# Altium schematic sheet belt_output.SchDoc
size A3
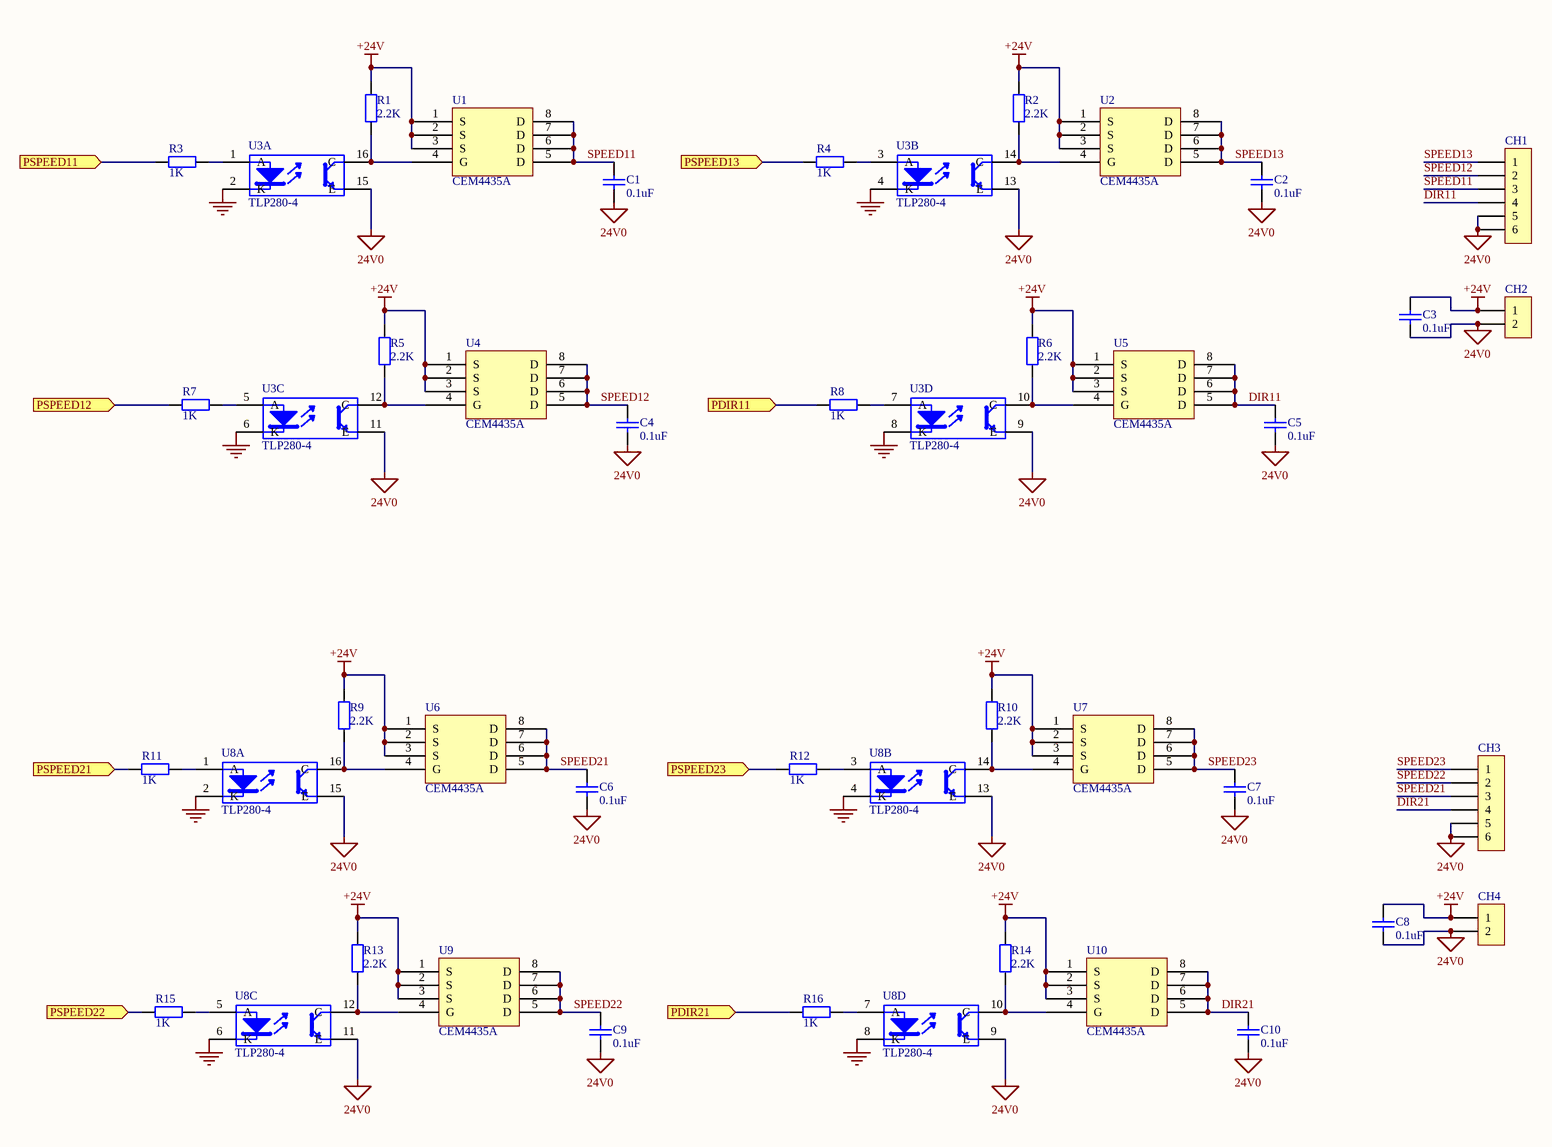
[diagram p0: belt_output.SchDoc]

## Parts
C1  value 0.1uF  [0805]  (hidden comment: Cap)
C2  value 0.1uF  [0805]  (hidden comment: Cap)
C3  value 0.1uF  [0805]  (hidden comment: Cap)
C4  value 0.1uF  [0805]  (hidden comment: Cap)
C5  value 0.1uF  [0805]  (hidden comment: Cap)
C6  value 0.1uF  [0805]  (hidden comment: Cap)
C7  value 0.1uF  [0805]  (hidden comment: Cap)
C8  value 0.1uF  [0805]  (hidden comment: Cap)
C9  value 0.1uF  [0805]  (hidden comment: Cap)
C10  value 0.1uF  [0805]  (hidden comment: Cap)
CH1  HEADER1X6  [CH3.96-6PIN]  (value not drawn)
CH2  HEADER1X2  [CH3.96-2PIN]  (value not drawn)
CH3  HEADER1X6  [CH3.96-6PIN]  (value not drawn)
CH4  HEADER1X2  [CH3.96-2PIN]  (value not drawn)
R1  value 2.2K  [0805]  (hidden comment: Res2)
R2  value 2.2K  [0805]  (hidden comment: Res2)
R3  value 1K  [0805]  (hidden comment: Res2)
R4  value 1K  [0805]  (hidden comment: Res2)
R5  value 2.2K  [0805]  (hidden comment: Res2)
R6  value 2.2K  [0805]  (hidden comment: Res2)
R7  value 1K  [0805]  (hidden comment: Res2)
R8  value 1K  [0805]  (hidden comment: Res2)
R9  value 2.2K  [0805]  (hidden comment: Res2)
R10  value 2.2K  [0805]  (hidden comment: Res2)
R11  value 1K  [0805]  (hidden comment: Res2)
R12  value 1K  [0805]  (hidden comment: Res2)
R13  value 2.2K  [0805]  (hidden comment: Res2)
R14  value 2.2K  [0805]  (hidden comment: Res2)
R15  value 1K  [0805]  (hidden comment: Res2)
R16  value 1K  [0805]  (hidden comment: Res2)
U1  CEM4435A  [SOP8-OP27]
U2  CEM4435A  [SOP8-OP27]
U3  TLP280-4  [SO16]  (parts A,B,C,D of 4)
U4  CEM4435A  [SOP8-OP27]
U5  CEM4435A  [SOP8-OP27]
U6  CEM4435A  [SOP8-OP27]
U7  CEM4435A  [SOP8-OP27]
U8  TLP280-4  [SO16]  (parts A,B,C,D of 4)
U9  CEM4435A  [SOP8-OP27]
U10  CEM4435A  [SOP8-OP27]

## Ports
PDIR11 (in), PDIR21 (in), PSPEED11 (in), PSPEED12 (in), PSPEED13 (in), PSPEED21 (in), PSPEED22 (in), PSPEED23 (in)

## Nets
24V0: C1.2 C2.2 C3.2 C4.2 C5.2 C6.2 C7.2 C8.2 C9.2 C10.2 CH1.5 CH1.6 CH2.2 CH3.5 CH3.6 CH4.2 U3.9(E) U3.11(E) U3.13(E) U3.15(E) U8.9(E) U8.11(E) U8.13(E) U8.15(E)
+24V: C3.1 C8.1 CH2.1 CH4.1 R1.2 R2.2 R5.2 R6.2 R9.2 R10.2 R13.2 R14.2 U1.1(S) U1.2(S) U1.3(S) U2.1(S) U2.2(S) U2.3(S) U4.1(S) U4.2(S) U4.3(S) U5.1(S) U5.2(S) U5.3(S) U6.1(S) U6.2(S) U6.3(S) U7.1(S) U7.2(S) U7.3(S) U9.1(S) U9.2(S) U9.3(S) U10.1(S) U10.2(S) U10.3(S)
GND: U3.2(K) U3.4(K) U3.6(K) U3.8(K) U8.2(K) U8.4(K) U8.6(K) U8.8(K)
DIR11: C5.1 CH1.4 U5.5(D) U5.6(D) U5.7(D) U5.8(D)
DIR21: C10.1 CH3.4 U10.5(D) U10.6(D) U10.7(D) U10.8(D)
PDIR11: R8.1 ; port PDIR11
PDIR21: R16.1 ; port PDIR21
PSPEED11: R3.1 ; port PSPEED11
PSPEED12: R7.1 ; port PSPEED12
PSPEED13: R4.1 ; port PSPEED13
PSPEED21: R11.1 ; port PSPEED21
PSPEED22: R15.1 ; port PSPEED22
PSPEED23: R12.1 ; port PSPEED23
SPEED11: C1.1 CH1.3 U1.5(D) U1.6(D) U1.7(D) U1.8(D)
SPEED12: C4.1 CH1.2 U4.5(D) U4.6(D) U4.7(D) U4.8(D)
SPEED13: C2.1 CH1.1 U2.5(D) U2.6(D) U2.7(D) U2.8(D)
SPEED21: C6.1 CH3.3 U6.5(D) U6.6(D) U6.7(D) U6.8(D)
SPEED22: C9.1 CH3.2 U9.5(D) U9.6(D) U9.7(D) U9.8(D)
SPEED23: C7.1 CH3.1 U7.5(D) U7.6(D) U7.7(D) U7.8(D)
NetR1_1: R1.1 U1.4(G) U3.16(C)
NetR2_1: R2.1 U2.4(G) U3.14(C)
NetR3_2: R3.2 U3.1(A)
NetR4_2: R4.2 U3.3(A)
NetR5_1: R5.1 U3.12(C) U4.4(G)
NetR6_1: R6.1 U3.10(C) U5.4(G)
NetR7_2: R7.2 U3.5(A)
NetR8_2: R8.2 U3.7(A)
NetR9_1: R9.1 U6.4(G) U8.16(C)
NetR10_1: R10.1 U7.4(G) U8.14(C)
NetR11_2: R11.2 U8.1(A)
NetR12_2: R12.2 U8.3(A)
NetR13_1: R13.1 U8.12(C) U9.4(G)
NetR14_1: R14.1 U8.10(C) U10.4(G)
NetR15_2: R15.2 U8.5(A)
NetR16_2: R16.2 U8.7(A)

## Library data of the parts
C1-C10 = Cap: Capacitor; Published: 8-Jun-2000; LatestRevisionDate: 17-Jul-2002; LatestRevisionNote: Re-released for DXP Platform.; PackageReference: RAD-0.3; Publisher: Altium Limited
R1-R16 = Res2: Resistor; Published: 8-Jun-2000; LatestRevisionDate: 17-Jul-2002; LatestRevisionNote: Re-released for DXP Platform.; PackageReference: AXIAL-0.4; Publisher: Altium Limited
U3 U8 = TLP521-4